# Altium schematic sheet Sensors.SchDoc
size A
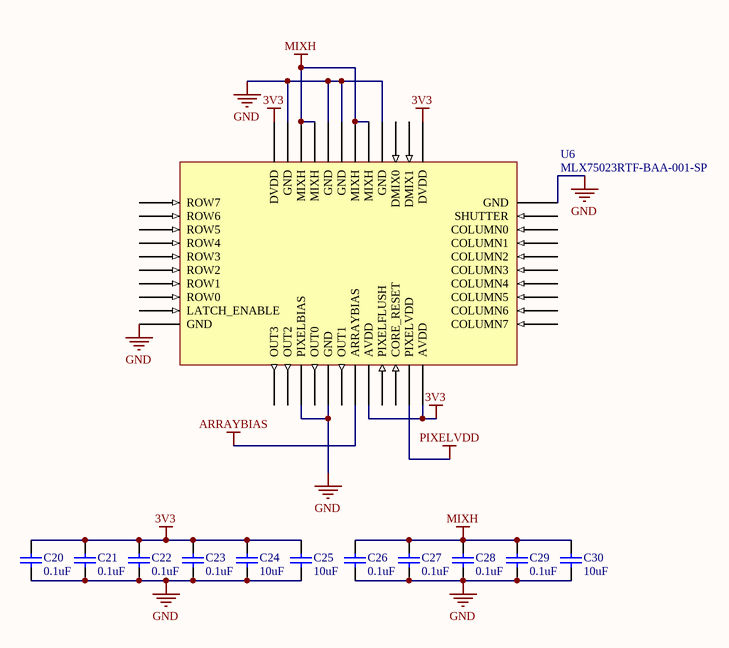
[diagram p0: Sensors.SchDoc]

## Parts
C20  value 0.1uF  [C0402[1005X55]]  (hidden comment: 0.1uF 6.3V 0402)
C21  value 0.1uF  [C0402[1005X55]]  (hidden comment: 0.1uF 6.3V 0402)
C22  value 0.1uF  [C0402[1005X55]]  (hidden comment: 0.1uF 6.3V 0402)
C23  value 0.1uF  [C0402[1005X55]]  (hidden comment: 0.1uF 6.3V 0402)
C24  value 10uF  [C0402[1005X55]]  (hidden comment: 10uF 6.3V 0402)
C25  value 10uF  [C0402[1005X55]]  (hidden comment: 10uF 6.3V 0402)
C26  value 0.1uF  [C0402[1005X55]]  (hidden comment: 0.1uF 6.3V 0402)
C27  value 0.1uF  [C0402[1005X55]]  (hidden comment: 0.1uF 6.3V 0402)
C28  value 0.1uF  [C0402[1005X55]]  (hidden comment: 0.1uF 6.3V 0402)
C29  value 0.1uF  [C0402[1005X55]]  (hidden comment: 0.1uF 6.3V 0402)
C30  value 10uF  [C0402[1005X55]]  (hidden comment: 10uF 6.3V 0402)
U6  MLX75023RTF-BAA-001-SP  [BGA-44]

## Nets
3V3: C20.2 C21.2 C22.2 C23.2 C24.2 C25.2 U6.18(AVDD) U6.22(AVDD) U6.33(DVDD) U6.44(DVDD)
ARRAYBIAS: U6.17(ARRAYBIAS)
GND: C20.1 C21.1 C22.1 C23.1 C24.1 C25.1 C26.1 C27.1 C28.1 C29.1 C30.1 U6.10(GND) U6.13(PIXELBIAS) U6.15(GND) U6.32(GND) U6.36(GND) U6.39(GND) U6.40(GND) U6.43(GND)
MIXH: C26.2 C27.2 C28.2 C29.2 C30.2 U6.37(MIXH) U6.38(MIXH) U6.41(MIXH) U6.42(MIXH)
PIXELVDD: U6.21(PIXELVDD)

Not connected (* = marked no-connect by the designer): U6 1(ROW7) 2(ROW6) 3(ROW5) 4(ROW4) 5(ROW3) 6(ROW2) 7(ROW1) 8(ROW0) 9(LATCH_ENABLE) 11(OUT3) 12(OUT2) 14(OUT0) 16(OUT1) 19(PIXELFLUSH) 20(CORE_RESET) 23(COLUMN7) 24(COLUMN6) 25(COLUMN5) 26(COLUMN4) 27(COLUMN3) 28(COLUMN2) 29(COLUMN1) 30(COLUMN0) 31(SHUTTER) 34(DMIX1) 35(DMIX0)

## Library data of the parts
C20-C23 C26-C29 = CAP_0.1uF_6.3V_0402_10%: 0.1uF 6.3V 10% 0402 (1005 Metric); PartNumber: GRM155R70J104KA01D; Manufacturer: Murata; Mounting Technology: Surface Mount; PackageReference: 0402; PackageDescription: 0402 (1005 Metric); Voltage: 6.3V; Tolerance: 10%
C24 C25 C30 = CAP_10uF_6.3V_0402_20%: 10uF 6.3V 20% 0402 (1005 Metric); PartNumber: GRM155R60J106ME44D; Manufacturer: Murata; Mounting Technology: Surface Mount; PackageReference: 0402; PackageDescription: 0402 (1005 Metric); Voltage: 6.3V; Tolerance: 20%
U6 = MLX75023RTF-BAA-001-SP: Manufacturer: Melexis; PartNumber: MLX75023RTF-BAA-001-SP; Mounting Technology: Surface Mount; PackageReference: BGA-44